# EAGLE schematic lp_board (EAGLE 9.5.0)
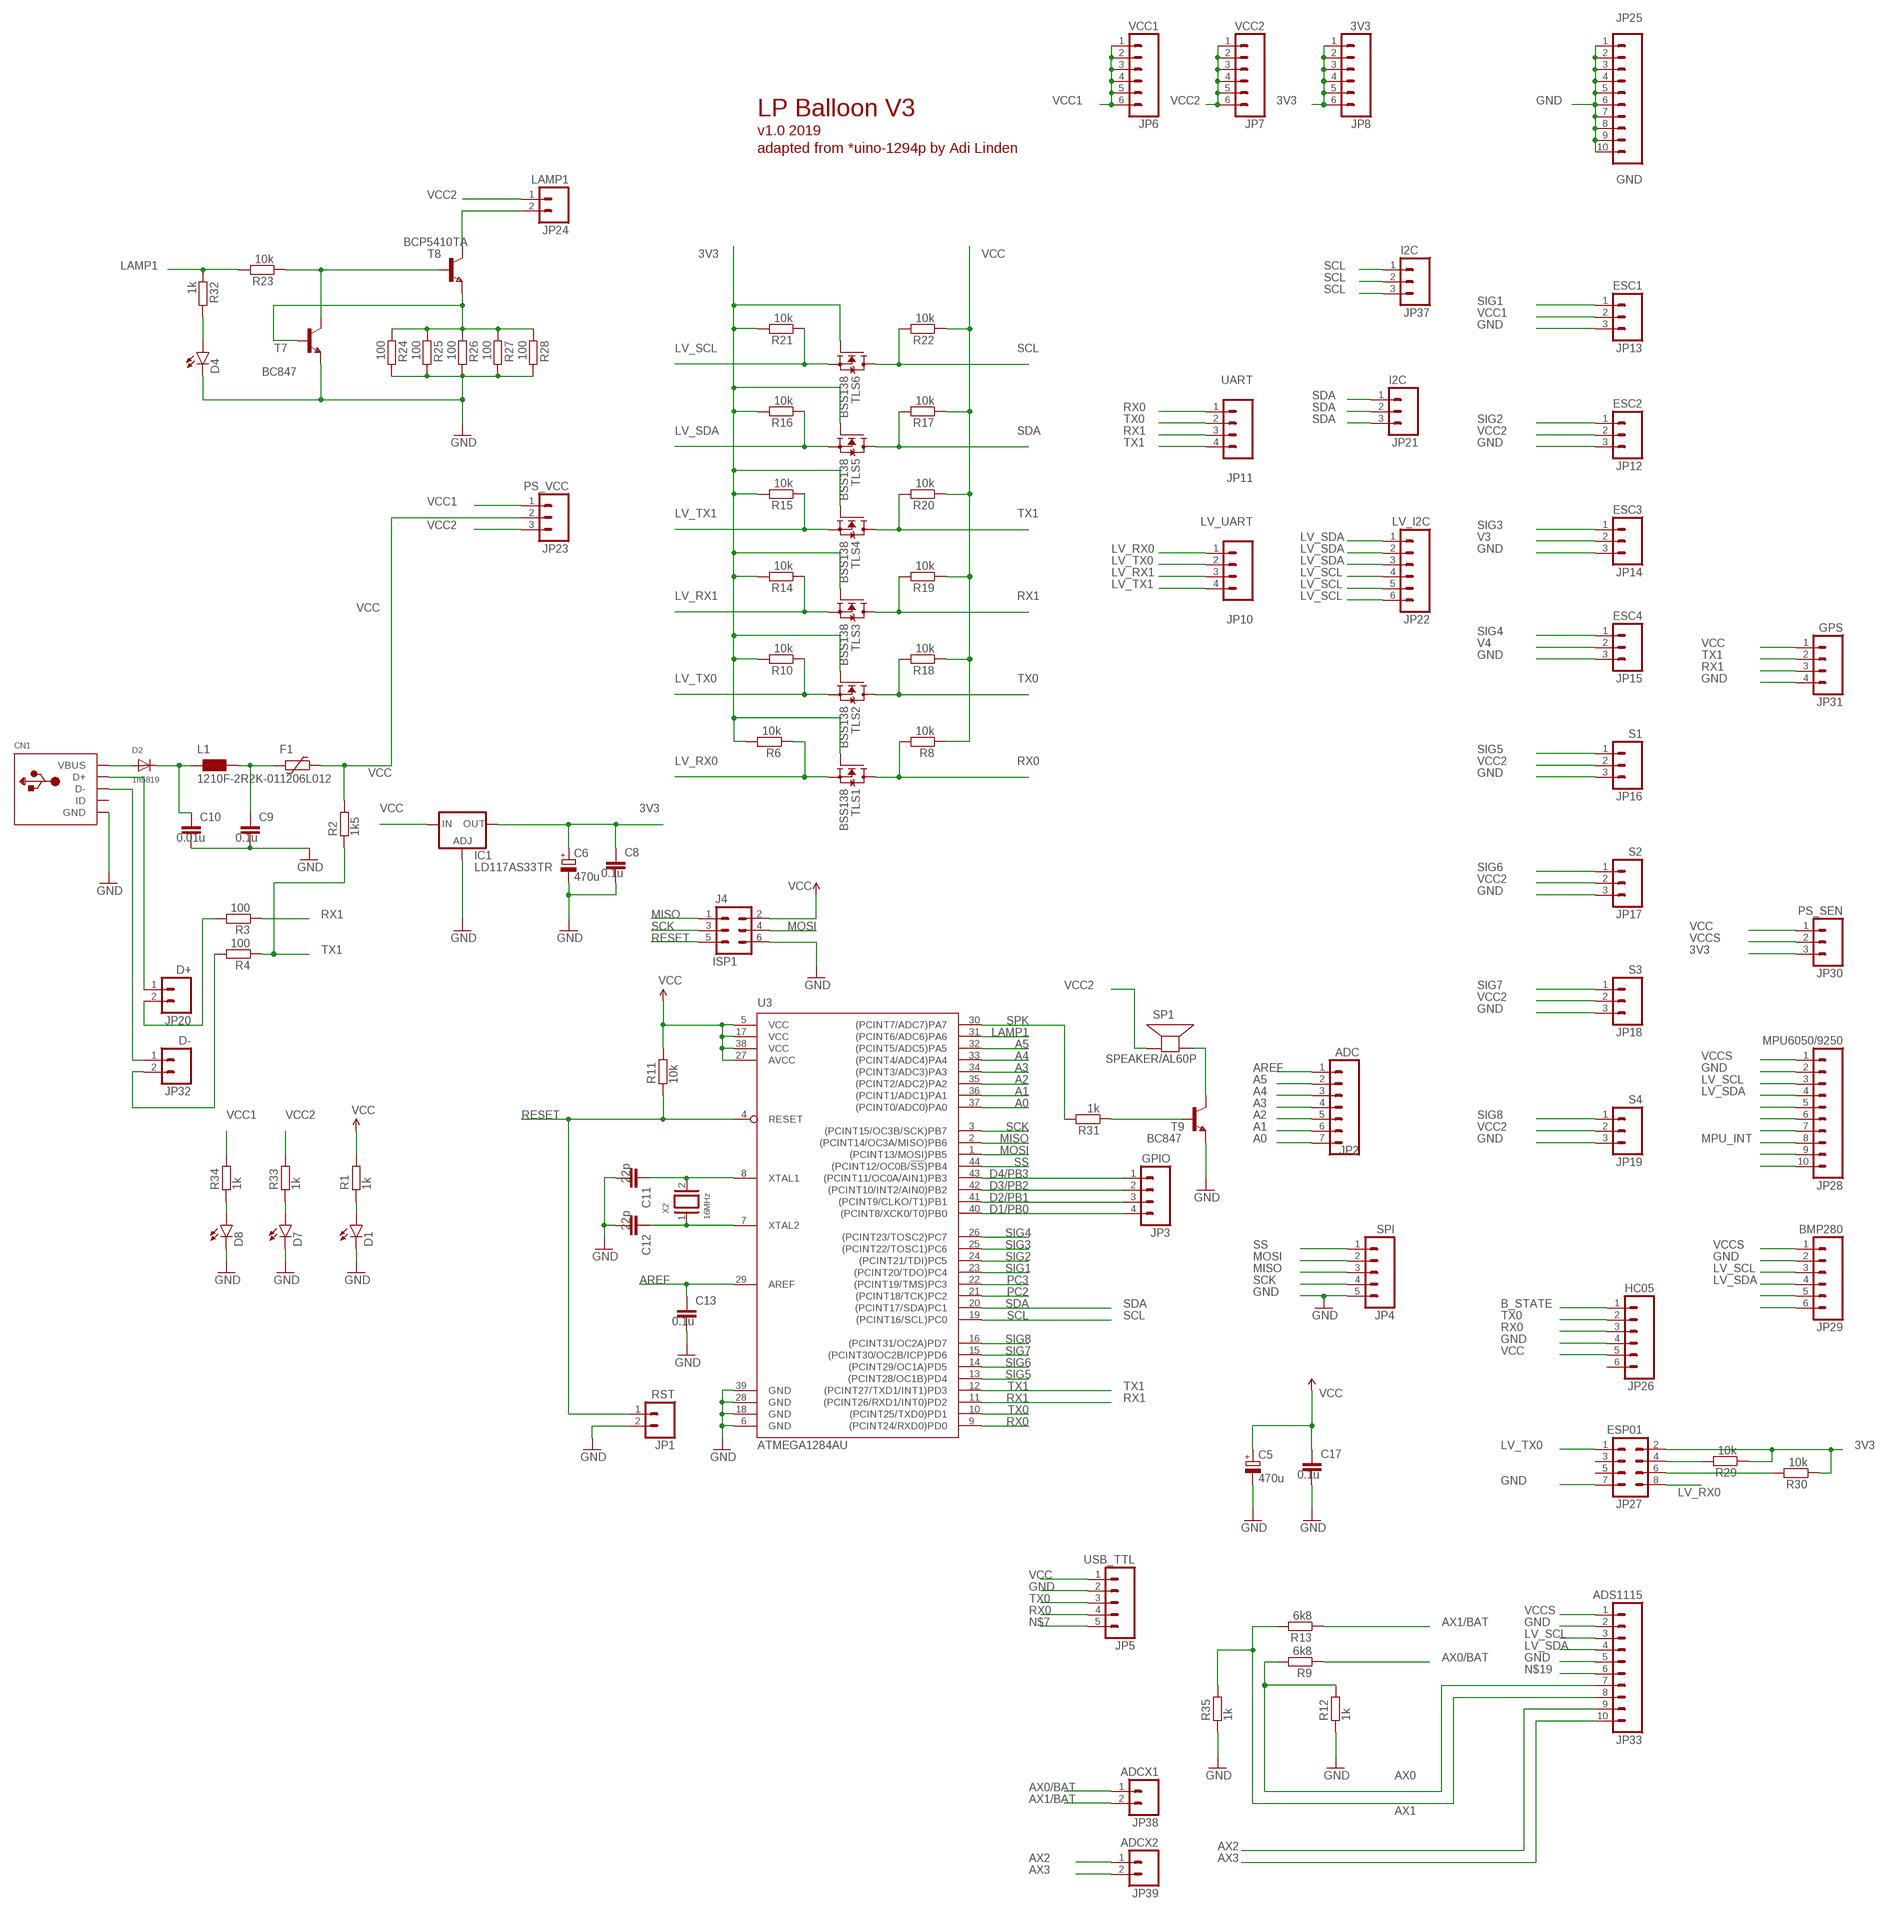
[diagram p0: schematic, sheet 1]

## Parts
C5  470u  CPOL-EUE5-10.5  [E5-10,5]
C6  470u  CPOL-EUE5-10.5  [E5-10,5]
C8  0.1u  C-EUC0603  [C0603]
C9  0.1u  C-EUC0603  [C0603]
C10  0.01u  C-EUC0603  [C0603]
C11  22p  C-EUC0603  [C0603]
C12  22p  C-EUC0603  [C0603]
C13  0.1u  C-EUC0603  [C0603]
C17  0.1u  C-EUC0603  [C0603]
CN1  USBMINIB  [USB-MINIB]
D1  PWR  LEDSML0805  [SML0805]
D2  1n5819  DIODESOD-123  [SOD-123]
D4  LAMP1  LEDSML0805  [SML0805]
D7  PWR2  LEDSML0805  [SML0805]
D8  PWR1  LEDSML0805  [SML0805]
F1  1206L012  [1206L]
IC1  LD117AS33TR  [SOT223]
J4  ISP1  M03X2-ROUND  [2X03_ROUND]
JP1  RST  M02PTH  [1X02]
JP2  ADC  M07  [1X07]
JP3  GPIO  M04PTH  [1X04]
JP4  SPI  M05PTH  [1X05]
JP5  USB_TTL  M05PTH  [1X05]
JP6  VCC1  M06SIP  [1X06]
JP7  VCC2  M06SIP  [1X06]
JP8  3V3  M06SIP  [1X06]
JP10  LV_UART  M04PTH  [1X04]
JP11  UART  M04PTH  [1X04]
JP12  ESC2  M03PTH  [1X03]
JP13  ESC1  M03PTH  [1X03]
JP14  ESC3  M03PTH  [1X03]
JP15  ESC4  M03PTH  [1X03]
JP16  S1  M03PTH  [1X03]
JP17  S2  M03PTH  [1X03]
JP18  S3  M03PTH  [1X03]
JP19  S4  M03PTH  [1X03]
JP20  D+  M02PTH  [1X02]
JP21  I2C  M03PTH  [1X03]
JP22  LV_I2C  M06SIP  [1X06]
JP23  PS_VCC  M03PTH  [1X03]
JP24  LAMP1  M02PTH  [1X02]
JP25  GND  M10"  [1X10]
JP26  HC05  M06SIP  [1X06]
JP27  ESP01  MA04-2  [MA04-2]
JP28  MPU6050/9250  M10"  [1X10]
JP29  BMP280  M06SIP  [1X06]
JP30  PS_SEN  M03PTH  [1X03]
JP31  GPS  M04PTH  [1X04]
JP32  D-  M02PTH  [1X02]
JP33  ADS1115  M10"  [1X10]
JP37  I2C  M03PTH  [1X03]
JP38  ADCX1  M02PTH  [1X02]
JP39  ADCX2  M02PTH  [1X02]
L1  1210F-2R2K-01  WE-CBF_1210  [1210]
R1  1k  R-EU_R0603  [R0603]
R2  1k5  R-EU_R0603  [R0603]
R3  100  R-EU_R0603  [R0603]
R4  100  R-EU_R0603  [R0603]
R6  10k  R-EU_R0603  [R0603]
R8  10k  R-EU_R0603  [R0603]
R9  6k8  R-EU_R0603  [R0603]
R10  10k  R-EU_R0603  [R0603]
R11  10k  R-EU_R0603  [R0603]
R12  1k  R-EU_R0603  [R0603]
R13  6k8  R-EU_R0603  [R0603]
R14  10k  R-EU_R0603  [R0603]
R15  10k  R-EU_R0603  [R0603]
R16  10k  R-EU_R0603  [R0603]
R17  10k  R-EU_R0603  [R0603]
R18  10k  R-EU_R0603  [R0603]
R19  10k  R-EU_R0603  [R0603]
R20  10k  R-EU_R0603  [R0603]
R21  10k  R-EU_R0603  [R0603]
R22  10k  R-EU_R0603  [R0603]
R23  10k  R-EU_R0603  [R0603]
R24  100  R-EU_R0603  [R0603]
R25  100  R-EU_R0603  [R0603]
R26  100  R-EU_R0603  [R0603]
R27  100  R-EU_R0603  [R0603]
R28  100  R-EU_R0603  [R0603]
R29  10k  R-EU_R0603  [R0603]
R30  10k  R-EU_R0603  [R0603]
R31  1k  R-EU_R0603  [R0603]
R32  1k  R-EU_R0603  [R0603]
R33  1k  R-EU_R0603  [R0603]
R34  1k  R-EU_R0603  [R0603]
R35  1k  R-EU_R0603  [R0603]
SP1  SPEAKER/AL60P  [AL60P]
T7  BC847  [SOT23]
T8  BCP5410TA  NPNSOT223  [SOT223]
T9  BC847  [SOT23]
TLS1  BSS138  MOSFET-N-SOT23  [SOT23]
TLS2  BSS138  MOSFET-N-SOT23  [SOT23]
TLS3  BSS138  MOSFET-N-SOT23  [SOT23]
TLS4  BSS138  MOSFET-N-SOT23  [SOT23]
TLS5  BSS138  MOSFET-N-SOT23  [SOT23]
TLS6  BSS138  MOSFET-N-SOT23  [SOT23]
U3  ATMEGA1284AU  ATMEGA1284P-AU  [TQFP44]
X2  16MHz  XTAL/S  [QS]

## Nets
3V3: C6.+ C8.1 IC1.4(OUT) JP8.1 JP8.2 JP8.3 JP8.4 JP8.5 JP8.6 JP27.2 JP30.3 R6.2 R10.2 R14.2 R15.2 R16.2 R21.2 R29.1 R30.1 TLS1.1(G) TLS2.1(G) TLS3.1(G) TLS4.1(G) TLS5.1(G) TLS6.1(G)
A0: JP2.7 U3.37((PCINT0/ADC0)PA0)
A1: JP2.6 U3.36((PCINT1/ADC1)PA1)
A2: JP2.5 U3.35((PCINT2/ADC2)PA2)
A3: JP2.4 U3.34((PCINT3/ADC3)PA3)
A4: JP2.3 U3.33((PCINT4/ADC4)PA4)
A5: JP2.2 U3.32((PCINT5/ADC5)PA5)
AREF: C13.1 JP2.1 U3.29(AREF)
AX0: JP33.7 R9.2 R12.2
AX0/BAT: JP38.1 R9.1
AX1: JP33.8 R13.2 R35.2
AX1/BAT: JP38.2 R13.1
AX2: JP33.9 JP39.1
AX3: JP33.10 JP39.2
B_STATE: JP26.1
D1/PB0: JP3.4 U3.40((PCINT8/XCK0/T0)PB0)
D2/PB1: JP3.3 U3.41((PCINT9/CLKO/T1)PB1)
D3/PB2: JP3.2 U3.42((PCINT10/INT2/AIN0)PB2)
D4/PB3: JP3.1 U3.43((PCINT11/OC0A/AIN1)PB3)
GND: C5.- C6.- C8.2 C9.2 C10.2 C11.2 C12.2 C13.2 C17.2 CN1.GND D1.C D4.C D7.C D8.C IC1.1(ADJ) J4.6 JP1.2 JP4.5 JP5.2 JP12.3 JP13.3 JP14.3 JP15.3 JP16.3 JP17.3 JP18.3 JP19.3 JP25.1 JP25.2 JP25.3 JP25.4 JP25.5 JP25.6 JP25.7 JP25.8 JP25.9 JP25.10 JP26.4 JP27.7 JP28.2 JP29.2 JP31.4 JP33.2 JP33.5 R12.1 R24.2 R25.2 R26.2 R27.2 R28.2 R35.1 T7.2(E) T9.2(E) U3.6(GND) U3.18(GND) U3.28(GND) U3.39(GND)
LAMP1: R23.2 R32.1 U3.31((PCINT6/ADC6)PA6)
LV_RX0: JP10.1 JP27.8 R6.1 TLS1.2(S)
LV_RX1: JP10.3 R14.1 TLS3.2(S)
LV_SCL: JP22.4 JP22.5 JP22.6 JP28.3 JP29.3 JP33.3 R21.1 TLS6.2(S)
LV_SDA: JP22.1 JP22.2 JP22.3 JP28.4 JP29.4 JP33.4 R16.1 TLS5.2(S)
LV_TX0: JP10.2 JP27.1 R10.1 TLS2.2(S)
LV_TX1: JP10.4 R15.1 TLS4.2(S)
MISO: J4.1 JP4.3 U3.2((PCINT14/OC3A/MISO)PB6)
MOSI: J4.4 JP4.2 U3.1((PCINT13/MOSI)PB5)
MPU_INT: JP28.8
N$1: R23.1 T7.3(C) T8.1(B)
N$2: CN1.VBUS D2.A
N$3: CN1.D+ JP20.1
N$4: CN1.D- JP32.1
N$5: JP32.2 R4.2
N$6: JP20.2 R3.2
N$7: JP5.5
N$11: R24.1 R25.1 R26.1 R27.1 R28.1 T7.1(B) T8.3(E)
N$12: R31.1 T9.1(B)
N$17: JP24.2 T8.2(C) T8.4(C)
N$18: SP1.2(-) T9.3(C)
N$19: JP33.6
N$20: D4.A R32.2
N$21: JP27.4 R29.2
N$22: JP27.6 R30.2
N$23: C11.1 U3.8(XTAL1) X2.2
N$24: C12.1 U3.7(XTAL2) X2.1
N$25: JP28.5
N$28: JP28.6
N$32: JP28.7
N$33: JP29.5
N$34: D1.A R1.1
N$35: JP28.9
N$36: JP28.10
N$37: JP29.6
N$38: C9.1 F1.2 L1.2
N$39: D7.A R33.1
N$40: D8.A R34.1
PC2: U3.21((PCINT18/TCK)PC2)
PC3: U3.22((PCINT19/TMS)PC3)
RESET: J4.5 JP1.1 R11.1 U3.4(RESET)
RX0: JP5.4 JP11.1 JP26.3 R8.2 TLS1.3(D) U3.9((PCINT24/RXD0)PD0)
RX1: JP11.3 JP31.3 R3.1 R19.2 TLS3.3(D) U3.11((PCINT26/RXD1/INT0)PD2)
SCK: J4.3 JP4.4 U3.3((PCINT15/OC3B/SCK)PB7)
SCL: JP37.1 JP37.2 JP37.3 R22.2 TLS6.3(D) U3.19((PCINT16/SCL)PC0)
SDA: JP21.1 JP21.2 JP21.3 R17.2 TLS5.3(D) U3.20((PCINT17/SDA)PC1)
SIG1: JP13.1 U3.23((PCINT20/TDO)PC4)
SIG2: JP12.1 U3.24((PCINT21/TDI)PC5)
SIG3: JP14.1 U3.25((PCINT22/TOSC1)PC6)
SIG4: JP15.1 U3.26((PCINT23/TOSC2)PC7)
SIG5: JP16.1 U3.13((PCINT28/OC1B)PD4)
SIG6: JP17.1 U3.14((PCINT29/OC1A)PD5)
SIG7: JP18.1 U3.15((PCINT30/OC2B/ICP)PD6)
SIG8: JP19.1 U3.16((PCINT31/OC2A)PD7)
SPK: R31.2 U3.30((PCINT7/ADC7)PA7)
SS: JP4.1 U3.44((PCINT12/OC0B/!SS!)PB4)
TX0: JP5.3 JP11.2 JP26.2 R18.2 TLS2.3(D) U3.10((PCINT25/TXD0)PD1)
TX1: JP11.4 JP31.2 R2.1 R4.1 R20.2 TLS4.3(D) U3.12((PCINT27/TXD1/INT1)PD3)
V3: JP14.2
V4: JP15.2
VBUS: C10.1 D2.C L1.1
VCC: C5.+ C17.1 F1.1 IC1.3(IN) J4.2 JP5.1 JP23.2 JP26.5 JP30.1 JP31.1 R1.2 R2.2 R8.1 R11.2 R17.1 R18.1 R19.1 R20.1 R22.1 U3.5(VCC) U3.17(VCC) U3.27(AVCC) U3.38(VCC)
VCC1: JP6.1 JP6.2 JP6.3 JP6.4 JP6.5 JP6.6 JP13.2 JP23.1 R34.2
VCC2: JP7.1 JP7.2 JP7.3 JP7.4 JP7.5 JP7.6 JP12.2 JP16.2 JP17.2 JP18.2 JP19.2 JP23.3 JP24.1 R33.2 SP1.1(+)
VCCS: JP28.1 JP29.1 JP30.2 JP33.1
Unconnected: CN1.ID JP26.6 JP27.3 JP27.5

## Notes on the sheet
- LP Balloon V3
- v1.0 2019
- adapted from *uino-1294p by Adi Linden

## Library data of the parts
C5 C6 = rcl:CPOL-EU: POLARIZED CAPACITOR, European symbol; SPICEPREFIX: C
C8-C13 C17 = rcl:C-EU: CAPACITOR, European symbol; SPICEPREFIX: C
CN1 = adafruit:USB: USB Connectors USBMINIB - Surface Mount Female Mini-B USB Connector 4UConnector: 06564 By microbuilder.eu Thru-hole RA Female Mini-B USB Connector 4UConnector: 18732 By ladyada.net
D1 D4 D7 D8 = led:LED: LED OSRAM: - CHIPLED LG R971, LG N971, LY N971, LG Q971, LY Q971, LO R971, LY R971 LH N974, LH R974 LS Q976, LO Q976, LY Q976 LO Q996 - Hyper CHIPLED LW Q18S LB Q993, LB Q99A, LB R99A - SideLED LS A670, LO A670, LY A670, LG A670, LP A670 LB A673, LV A673, LT A673, LW A673 LH A674 LY A675 LS A676, LA A676, LO A676, LY A676, LW A676 LS A679, LY A679, LG A679 - Hyper Micro SIDELED® LS Y876, LA Y876, LO Y876, LY Y876 LT Y87S - SmartLED LW L88C, LW L88S LB L89C, LB L89S, LG L890 LS L89K, LO L89K, LY L89K LS L896, LA L896, LO L896, LY L896 - TOPLED LS T670, LO T670, LY T670, LG T670, LP T670 LSG T670, LSP T670, LSY T670, LOP T670, LYG T670 LG T671, LOG T671, LSG T671 LB T673, LV T673, LT T673, LW T673 LH T674 LS T676, LA T676, LO T676, LY T676, LB T676, LH T676, LSB T676, LW T676 LB T67C, LV T67C, LT T67C, LS T67K, LO T67K, LY T67K, LW E67C LS E67B, LA E67B, LO E67B, LY E67B, LB E67C, LV E67C, LT E67C LW T67C LS T679, LY T679, LG T679 LS T770, LO T770, LY T770, LG T770, LP T770 LB T773, LV T773, LT T773, LW T773 LH T774 LS E675, LA E675, LY E675, LS T675 LS T776, LA T776, LO T776, LY T776, LB T776 LHGB T686 LT T68C, LB T68C - Hyper Mini TOPLED® LB M676 - Mini TOPLED Santana® LG M470 LS M47K, LO M47K, LY M47K Source: http://www.osram.convergy.de LUXEON: - LUMILED® LXK2-PW12-R00, LXK2-PW12-S00, LXK2-PW14-U00, LXK2-PW14-V00 LXK2-PM12-R00, LXK2-PM12-S00, LXK2-PM14-U00 LXK2-PE12-Q00, LXK2-PE12-R00, LXK2-PE12-S00, LXK2-PE14-T00, LXK2-PE14-U00 LXK2-PB12-K00, LXK2-PB12-L00, LXK2-PB12-M00, LXK2-PB14-N00, LXK2-PB14-P00, LXK2-PB14-Q00 LXK2-PR12-L00, LXK2-PR12-M00, LXK2-PR14-Q00, LXK2-PR14-R00 LXK2-PD12-Q00, LXK2-PD12-R00, LXK2-PD12-S00 LXK2-PH12-R00, LXK2-PH12-S00 LXK2-PL12-P00, LXK2-PL12-Q00, LXK2-PL12-R00 Source: www.luxeon.com KINGBRIGHT: KA-3528ASYC Source: www.kingbright.com
D2 = adafruit:DIODE: Diode SMADIODE - SMA Surface Mount Package 20V 1A Schottky Diode Digikey: 641-1014-6-ND DO-1N4148 - Through Hole Small Current Diode SOD-123 20V 1 A (.5mV Vf) Schottky Diode - Digikey: MBRX120TPMSCT-ND SOD-323 10V 570mA (.38mV Vf, 3ns) Schottky Diode - Digikey: ZLLS410CT-ND SOD-523 30V 30mA Schottky Diode (RB751S-40TE61) - Digikey: RB751S-40TE61CT-ND SOT23-R/W - SOT23 Package (R = Solder Paste/Reflow Ovens, W = Hand-Soldering) BAT54Film 40V 300mA - Digikey: 497-7162-1-ND
F1 = polyfuse-smd_10:?: Polyfuse Resettable PTC Source: http://www.littelfuse.com/products/resettable-ptcs.aspx; MF: Littelfuse; MPN: 1206L012; OC_FARNELL: 1596988; OC_NEWARK: 05M2298
IC1 = v-reg:LD117A?*: Low drop fixed and adjustable positive voltage regulators 1 A Source: http://www.st.com/stonline/products/literature/ds/7194/ld1117axx.pdf
J4 = adi-misc:M03X2: This is a 3x2 pin header Note: This part is based on the Sparkfun M04X2 header.
JP1 JP20 JP24 JP32 JP38 JP39 = SparkFun:M02: Header 2 Standard 2-pin 0.1" header. Use with straight break away headers (SKU : PRT-00116), right angle break away headers (PRT-00553), swiss pins (PRT-00743), machine pins (PRT-00117), and female headers (PRT-00115). Molex polarized connector foot print use with SKU : PRT-08233 with associated crimp pins and housings.
JP2 = SparkFun:M07: Header 7 Standard 7-pin 0.1" header. Use with straight break away headers (SKU : PRT-00116), right angle break away headers (PRT-00553), swiss pins (PRT-00743), machine pins (PRT-00117), and female headers (PRT-00115). NOTES ON THE VARIANTS LOCK and LOCK_LONGPADS... This footprint was designed to help hold the alignment of a through-hole component (i.e. 7-pin header) while soldering it into place. You may notice that each hole has been shifted either up or down by 0.005 of an inch from it's more standard position (which is usually a perfectly straight line). This slight alteration caused the pins (the squares in the middle) to touch the edges of the holes. Because they are alternating, it causes a "brace" to hold the header in place. 0.005 has proven to be the perfect amount of "off-center" position when using our standard breakaway headers. Although looks a little odd when you look at the bare footprint, once you have a header in there, the alteration is very hard to notice. Also, if you push a header all the way into place, it is covered up entirely on the bottom side. This idea of altering the position of holes to aid alignment will be further integrated into the Sparkfun Library for other footprints. It can help hold any component with 3 or more connection pins.
JP3 JP10 JP11 JP31 = SparkFun:M04: Header 4 Standard 4-pin 0.1" header. Use with straight break away headers (SKU : PRT-00116), right angle break away headers (PRT-00553), swiss pins (PRT-00743), machine pins (PRT-00117), and female headers (PRT-00115). Molex polarized connector foot print use with SKU : PRT-08231 with associated crimp pins and housings. 1MM SMD Version SKU: PRT-10208
JP4 JP5 = SparkFun:M05: Header 5 Standard 5-pin 0.1" header. Use with straight break away headers (SKU : PRT-00116), right angle break away headers (PRT-00553), swiss pins (PRT-00743), machine pins (PRT-00117), and female headers (PRT-00115). Molex polarized connector foot print use with SKU : PRT-08230 with associated crimp pins and housings.
JP6-JP8 JP22 JP26 JP29 = SparkFun:M06: Header 6 Standard 6-pin 0.1" header. Use with straight break away headers (SKU : PRT-00116), right angle break away headers (PRT-00553), swiss pins (PRT-00743), machine pins (PRT-00117), and female headers (PRT-00115). Molex polarized connector foot print use with SKU : PRT-08094 with associated crimp pins and housings. NOTES ON THE VARIANTS LOCK and LOCK_LONGPADS... This footprint was designed to help hold the alignment of a through-hole component (i.e. 6-pin header) while soldering it into place. You may notice that each hole has been shifted either up or down by 0.005 of an inch from it's more standard position (which is a perfectly straight line). This slight alteration caused the pins (the squares in the middle) to touch the edges of the holes. Because they are alternating, it causes a "brace" to hold the component in place. 0.005 has proven to be the perfect amount of "off-center" position when using our standard breakaway headers. Although looks a little odd when you look at the bare footprint, once you have a header in there, the alteration is very hard to notice. Also, if you push a header all the way into place, it is covered up entirely on the bottom side. This idea of altering the position of holes to aid alignment will be further integrated into the Sparkfun Library for other footprints. It can help hold any component with 3 or more connection pins.
JP12-JP19 JP21 JP23 JP30 JP37 = SparkFun:M03: Header 3 Standard 3-pin 0.1" header. Use with straight break away headers (SKU : PRT-00116), right angle break away headers (PRT-00553), swiss pins (PRT-00743), machine pins (PRT-00117), and female headers (PRT-00115). Molex polarized connector foot print use with SKU : PRT-08232 with associated crimp pins and housings.
JP25 JP28 JP33 = SparkFun:M10: Header 10 Standard 10-pin 0.1" header. Use with straight break away headers (SKU : PRT-00116), right angle break away headers (PRT-00553), swiss pins (PRT-00743), machine pins (PRT-00117), and female headers (PRT-00115).
JP27 = con-lstb2:MA04-2: PIN HEADER; OC_FARNELL: unknown; OC_NEWARK: unknown
L1 = wuerth-elektronik:WE-CBF: SMD EMI Suppression Ferrite Beads - excellent anti-EMI properties - low DCR - impedances till 3000 ohms - rated current up to 6 A
R1-R4 R6 R8-R35 = rcl:R-EU_: RESISTOR, European symbol; SPICEPREFIX: R
SP1 = adafruit:SPEAKER: SPEAKER Source: Buerklin Added PS12 (for part # PS1240 piezo) http://www.ladyada.net/library/pcb/eaglelibrary.html
T7 T9 = transistor:BC847: NPN TRANSISTOR
T8 = zetex:NPNSOT223: NPN TRANSISTOR; MPN: DJT4031N-13; OC_FARNELL: 1710672; OC_NEWARK: 25R4490
TLS1-TLS6 = we-transistor:MOSFET-N: N-Channel MOSFET (e.g. IRLML2502, BSS138)
U3 = adi-atmega:ATMEGA1284P: 8-bit Microcontroller with 64K Bytes In-System Programmable Flash Source: http://www.atmel.com/dyn/resources/prod_documents/doc2593.pdf; MPN: ATMEGA644PV-10AU; OC_FARNELL: 1455123; OC_NEWARK: 58M3748
X2 = special:XTAL/S: CRYSTAL